# EAGLE design phMeter v1.0 (EAGLE 6.4)
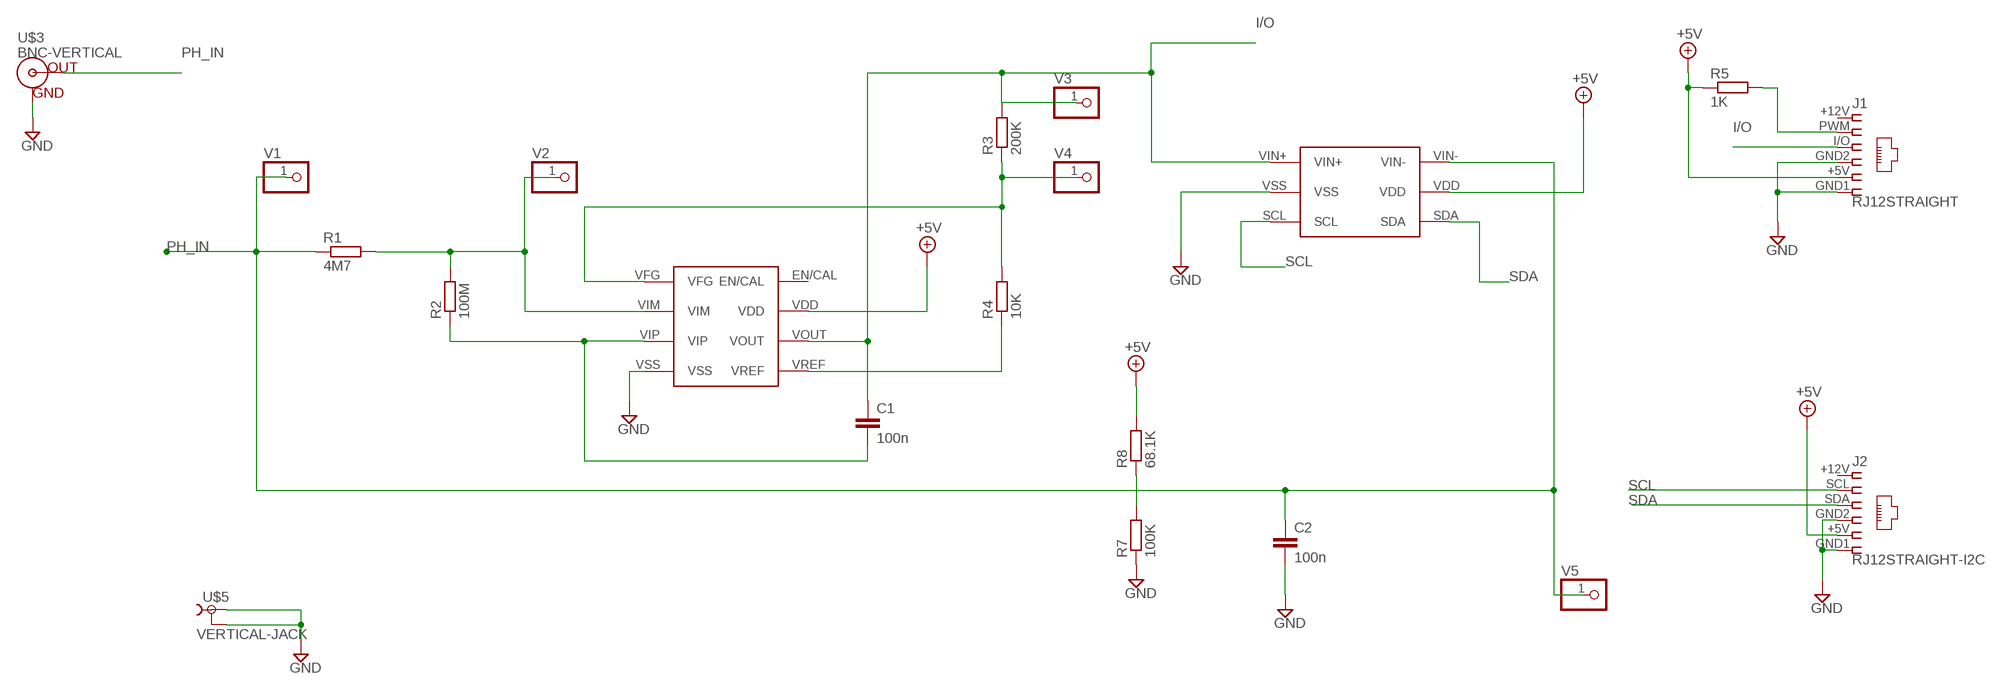
[diagram p0: schematic, sheet 1]

## Parts
C1  100n  C-EUC1206  [C1206]
C2  100n  C-EUC1206  [C1206]
J1  RJ12STRAIGHT  [RJ12-STRAIGHT]
J2  RJ12STRAIGHT-I2C  [RJ12-STRAIGHT-I2C]
R1  4M7  R-EU_R1206  [R1206]
R2  100M  R-EU_R1206  [R1206]
R3  200K  R-EU_R1206  [R1206]
R4  10K  R-EU_R1206  [R1206]
R5  1K  R-EU_R1206  [R1206]
R7  100K  R-EU_R1206  [R1206]
R8  68.1K  R-EU_R1206  [R1206]
U$1  MCP3425  [SOT-23-6]
U$2  MCP6N11010E  [SOIC]
U$3  BNC-VERTICAL  [BNC-VERTICAL]
U$5  VERTICAL-JACK  [VERTICAL-JACK]
V1  PINHD-1X1  [1X01]
V2  PINHD-1X1  [1X01]
V3  PINHD-1X1  [1X01]
V4  PINHD-1X1  [1X01]
V5  PINHD-1X1  [1X01]

## Nets
+5V: J1.+5V J2.+5V R5.1 R8.2 U$1.VDD U$2.VDD
GND: C2.2 J1.GND1 J1.GND2 J2.GND1 J2.GND2 R7.1 U$1.VSS U$2.VSS U$3.G(GND) U$5.P$1 U$5.P$2
I/O: C1.1 J1.I/O R3.2 U$1.VIN+ U$2.VOUT V3.1
N$1: R4.1 U$2.VREF
N$2: J1.PWM R5.2
N$4: R3.1 R4.2 U$2.VFG V4.1
N$6: C1.2 R2.1 U$2.VIP
N$11: R1.2 R2.2 U$2.VIM V2.1
N$17: R7.2 R8.1
PH_IN: C2.1 R1.1 U$1.VIN- U$3.S(OUT) V1.1 V5.1
SCL: J2.SCL U$1.SCL
SDA: J2.SDA U$1.SDA
Unconnected: J1.+12V J2.+12V U$2.EN/CAL

## Library data of the parts
C1 C2 = resistor:C-EU: CAPACITOR, European symbol
J1 J2 = lpatiny:RJ12: CORCOM Modular RJ Jacks No Shield Source: www.tycoelectronics.com .. ENG_DS_1654001_1099_RJ_L_0507.pdf
R1-R5 R7 R8 = resistor:R-EU_: RESISTOR, European symbol
U$1 = phMeter:MCP3425
U$2 = phMeter:MCP6N11010E
U$3 = phMeter:BNC-VERTICAL
U$5 = phMeter:VERTICAL-JACK
V1-V5 = pinhead:PINHD-1X1: PIN HEADER

## Board
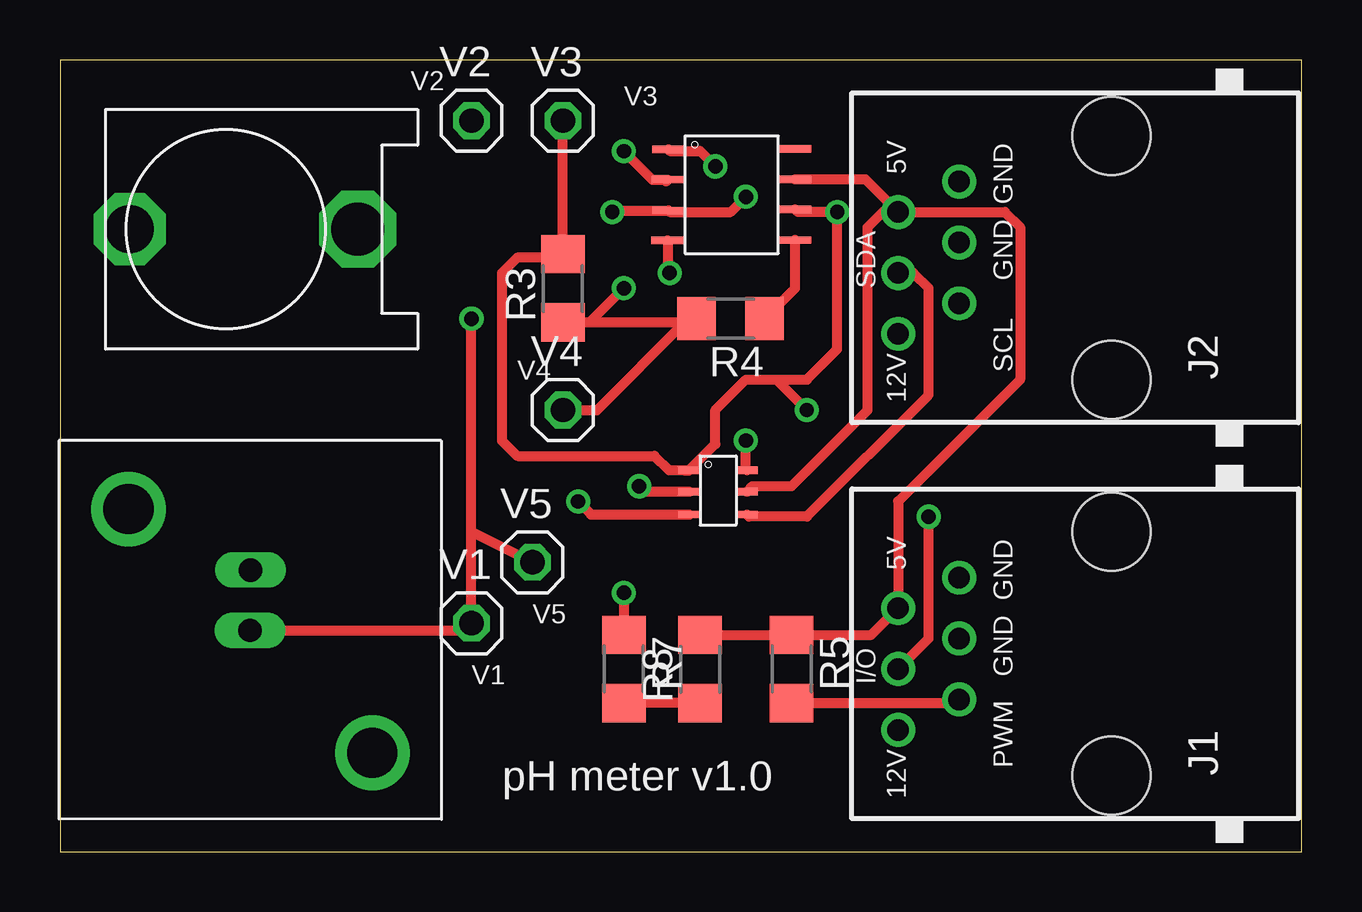
[diagram p1: board, top side]
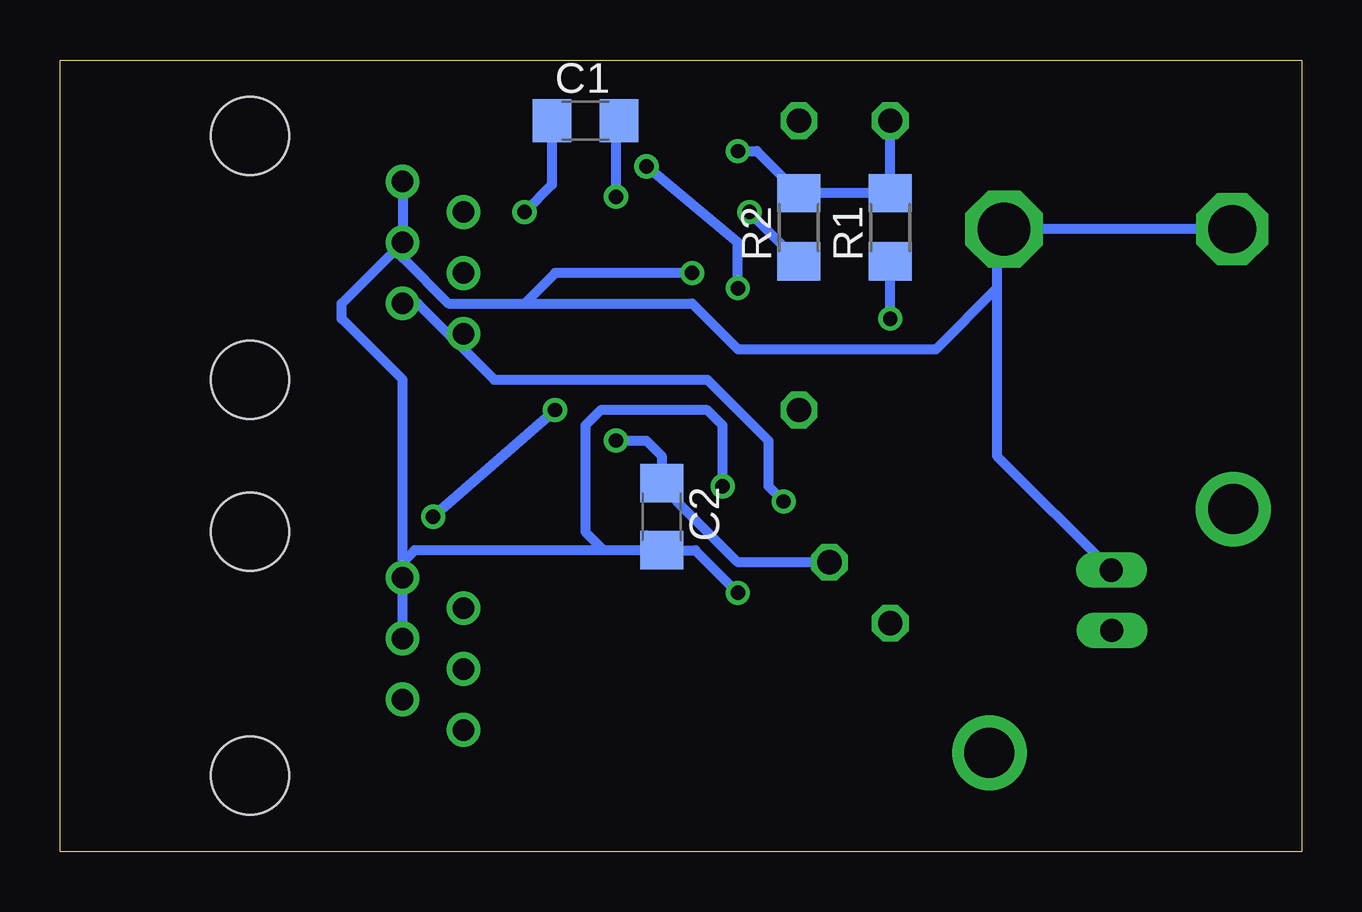
[diagram p2: board, bottom side, seen from below]

Size 51.74 x 33.01 mm. Coordinates in mm from the lower left corner, seen from the top.
Outline: 0,0 51.74,0 51.74,33.01 0,33.01 0,0
Copper layers (1*16): Top 0.035mm / dielectric 1.5mm / Bottom 0.035mm
Design rules "default": minimum track width 10mil, minimum drill 24mil, track to track 8mil, track to pad 8mil, pad to pad 8mil, via to via 8mil, smd to smd 8mil, copper to edge 40mil, drill to drill 8mil, minimum pad ring 10mil, minimum via ring 8mil, stop-mask expansion 4mil, vias tented up to drill 0mil, thermal gap 10mil

### Footprints (pad centres in the part's own frame; a part is rotated, then mirrored left to right if it is on the bottom)
C1206 = smd 1.6 x 1.8: 1 -1.4,0; 2 1.4,0
RJ12-STRAIGHT = drill 0.9 pad 1.4: +5V 1.905,8.89; +12V -3.175,8.89; GND1 3.175,6.35; GND2 0.635,6.35; I/O -0.635,8.89; PWM -1.905,6.35 | hole 3.251: -5.08,0; 5.08,0
RJ12-STRAIGHT-I2C = drill 0.9 pad 1.4: +5V 1.905,8.89; +12V -3.175,8.89; GND1 3.175,6.35; GND2 0.635,6.35; SCL -1.905,6.35; SDA -0.635,8.89 | hole 3.251: -5.08,0; 5.08,0
R1206 = smd 1.6 x 1.803: 1 -1.422,0; 2 1.422,0
SOT-23-6 = smd 0.305 x 0.9: SCL 2.45,-0.45; SDA 2.45,1.95; VDD 1.5,1.95; VIN+ 0.6,-0.45; VIN- 0.6,1.95; VSS 1.5,-0.45
SOIC = smd 0.305 x 1.35: EN/CAL 0.545,4.6; VDD 1.81,4.6; VFG 0.565,-0.69; VIM 1.825,-0.695; VIP 3.115,-0.69; VOUT 3.07,4.6; VREF 4.345,4.6; VSS 4.355,-0.715
BNC-VERTICAL = drill 0.97 long: G 5.4,-7.94; S 7.92,-7.96 | drill 2.09: P$3 13.02,-2.86; P$4 2.86,-13.02
VERTICAL-JACK = drill 2 octagon: P$1 5,-1 | drill 2.2 octagon: P$2 5,-10.5
1X01 = drill 1.016 octagon: 1 0,0

### Placement (x,y rotation side)
C1  29.84,30.48 0 bottom
C2  26.67,13.97 270 bottom
J1  43.81,8.26 90 top
J2  43.81,24.77 90 top
R1  17.14,26.04 90 bottom
R2  20.95,26.04 90 bottom
R3  20.95,23.49 90 top
R4  27.94,22.22 180 top
R5  30.48,7.62 270 top
R7  23.49,7.62 270 top
R8  26.67,7.62 90 top
U$1  26.67,16.51 270 top
U$2  26.03,29.84 270 top
U$3  15.88,17.14 270 top
U$5  1.9,20.95 90 top
V1  17.14,9.53 0 top
V2  17.14,30.48 0 top
V3  20.95,30.48 0 top
V4  20.95,18.41 0 top
V5  19.69,12.07 0 top

### Tracks (layer width: path | path; a pad name or v marks a point on that pad's centre or on a via)
+5V
  Top 0.406: U$2.VDD 33.56,28.04 J2.+5V | R8.2 R5.1 | R5.1 33.81,9.04 J1.+5V 34.92,10.79 34.92,14.61 40.01,19.68 40.01,26.04 39.37,26.67 J2.+5V | U$1.VDD 28.85,15.24 30.48,15.24 33.66,18.41 33.66,26.04 34.29,26.67 J2.+5V | R5.1 30.96,9.53 31.12,9.53
GND  (via drill 0.6)
  Top 0.406: v23.49,10.79 R7.1 | U$2.VSS 25.32,24.21 v25.4,24.13 | U$1.VSS 24.36,15.01 v24.13,15.24
  Bottom 0.406: U$5.P$1 U$5.P$2 12.7,25.95 12.7,23.49 | 12.7,23.49 12.7,16.51 U$3.G | J2.GND1 J2.GND2 | J2.GND2 37.46,24.77 35.56,22.86 32.38,22.86 | 32.38,22.86 25.4,22.86 23.49,20.95 15.24,20.95 12.7,23.49 | J1.GND2 J1.GND1 37.46,12.07 | 37.46,12.07 37.46,19.68 40.01,22.22 40.01,22.86 J2.GND2 | C2.2 29.08,12.57 | 29.08,12.57 36.96,12.57 37.46,12.07 | C2.2 25.27,12.57 v23.49,10.79 | v25.4,24.13 31.12,24.13 32.38,22.86 | C2.2 27.3,13.21 | v24.13,15.24 24.13,17.78 24.77,18.41 29.21,18.41 29.84,17.78 29.84,13.34 29.08,12.57
I/O  (via drill 0.6)
  Top 0.406: V3.1 R3.2 20.8,24.77 19.05,24.77 18.41,24.13 18.41,17.14 19.05,16.51 24.77,16.51 25.37,15.91 U$1.VIN+ | U$2.VOUT 30.74,26.67 v32.38,26.67 32.38,20.95 31.12,19.68 29.84,19.68 | U$1.VIN+ 27.3,16.99 27.3,18.41 28.57,19.68 29.84,19.68 | U$1.VIN+ 26.19,15.88 26.03,15.88 | J1.I/O 36.2,8.89 v36.2,13.97 | v31.12,18.41 29.84,19.68
  Bottom 0.406: C1.1 31.24,27.81 v32.38,26.67 | C1.1 31.24,30.98 31.12,31.12 | C1.1 31.24,29.97 31.12,29.84 | v36.2,13.97 v31.12,18.41
N$1
  Top 0.406: R4.1 30.63,23.5 U$2.VREF
N$2
  Top 0.406: R5.2 37.31,6.2 J1.PWM
N$4  (via drill 0.6)
  Top 0.406: 26.03,22.07 R3.1 22.07,22.07 v23.49,23.49 | 26.03,22.07 26.37,22.07 R4.2 26.03,22.22 | V4.1 22.38,18.41 26.03,22.07 | U$2.VFG 25.41,29.21 26.67,29.21 v27.3,28.57
  Bottom 0.406: v23.49,23.49 23.49,25.4 v27.3,28.57
N$6  (via drill 0.6)
  Top 0.406: v23.01,26.67 23.07,26.73 U$2.VIP 25.41,26.67 27.94,26.67 v28.57,27.3
  Bottom 0.406: R2.1 v23.01,26.67 | C1.2 28.45,29.97 28.57,29.84 v28.57,27.3
N$11  (via drill 0.6)
  Top 0.406: 25.26,27.94 U$2.VIM 24.69,28.02 v23.49,29.21
  Bottom 0.406: V2.1 R1.2 R2.2 arc-90 21.44,27.94 22.71,29.21 v23.49,29.21
N$17
  Top 0.406: R8.1 R7.2
PH_IN  (via drill 0.6)
  Top 0.406: U$3.S 16.84,9.23 V1.1 17.14,13.34 | 17.14,13.34 v17.14,22.22 | V5.1 17.14,13.34 | U$1.VIN- 28.57,15.96 v28.57,17.14
  Bottom 0.406: v17.14,22.22 R1.1 | v28.57,17.14 27.3,17.14 26.67,16.51 C2.1 26.54,15.37 26.03,15.88 26.03,14.61 23.49,12.07 V5.1
SCL  (via drill 0.6)
  Top 0.406: U$1.SCL 22.13,14.06 v21.59,14.61
  Bottom 0.406: J2.SCL 36.83,22.86 33.66,19.68 24.77,19.68 22.23,17.14 22.23,15.24 v21.59,14.61
SDA
  Top 0.406: J2.SDA 35.56,24.13 36.2,23.49 36.2,19.05 31.12,13.97 28.71,13.97 U$1.SDA

### Text on the board
_tsilk: V2 | V3 | V4 | V5 | V1 | pH meter v1.0